# EAGLE design fish_tank (EAGLE 7.5.0)

## Sheet 1 of 2
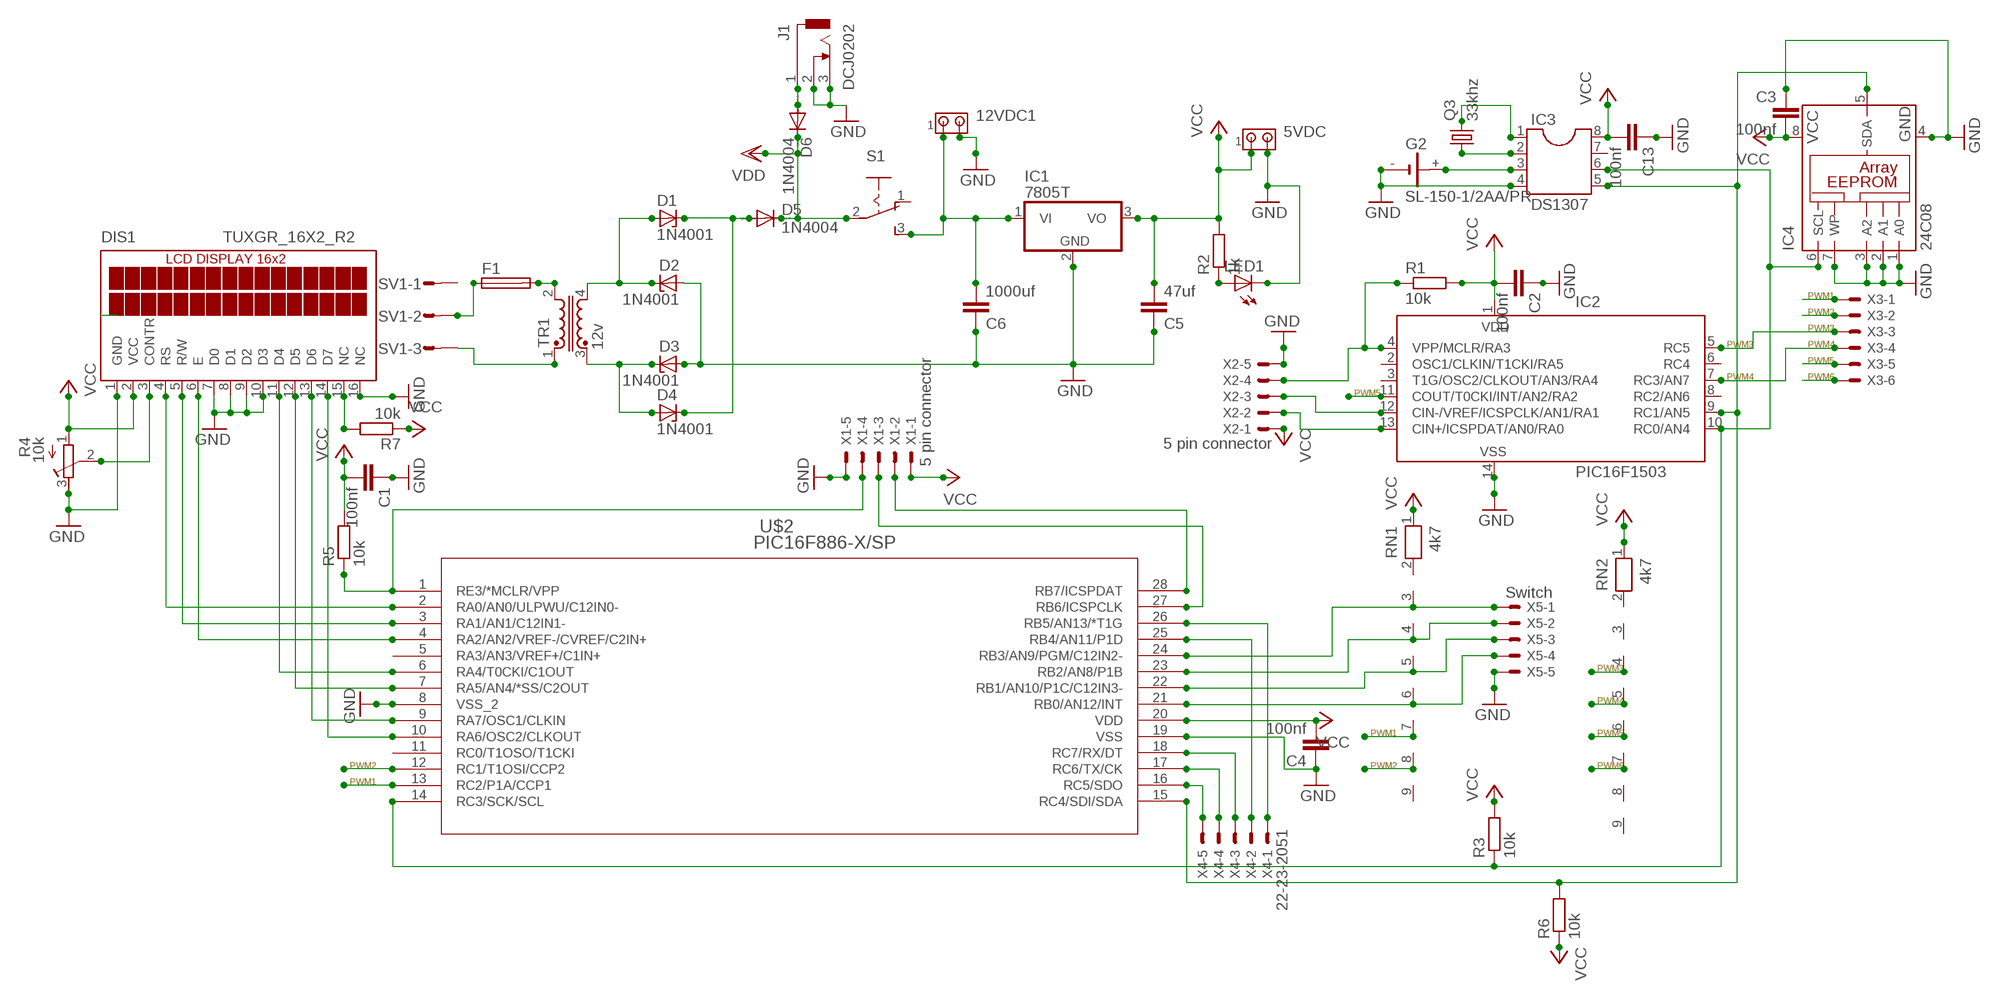
[diagram p0: schematic, sheet 1]

### Parts
5VDC  MTA02-100  [10X02MTA]
12VDC1  MTA02-100  [10X02MTA]
C1  100nf  C2.5/4  [C2.5-4]
C2  100nf  C2.5/4  [C2.5-4]
C3  100nf  C5/2.5  [C5B2.5]
C4  100nf  C2.5/4  [C2.5-4]
C5  47uf  C5/2.5  [C5B2.5]
C6  1000uf  C5/2.5  [C5B2.5]
C13  100nf  C5/2.5  [C5B2.5]
D1  1N4001  1N821  [DO35Z10]
D2  1N4001  1N821  [DO35Z10]
D3  1N4001  1N821  [DO35Z10]
D4  1N4001  1N821  [DO35Z10]
D5  1N4004  [DO41-10]
D6  1N4004  [DO41-10]
DIS1  TUXGR_16X2_R2  [TUXGR_16X2_R2]
F1  SH25  [SH25]
G2  SL-150-1/2AA/PR  [SL-150-1/2AA/PR]
IC1  7805T  [TO220H]
IC2  PIC16F1503  PIC16F676P  [DIL14]
IC3  DS1307  DIL8  [DIL08]
IC4  24C08  24C04CP  [DIL8]
J1  DCJ0202  [DCJ0202]
LED1  LED3MM  [LED3MM]
Q3  33khz  CRYSTALTC26H  [TC26H]
R1  10k  R-EU_0207/7  [0207/7]
R2  1k  R-EU_0204/5  [0204/5]
R3  10k  R-EU_0207/7  [0207/7]
R4  10k  R-TRIMM64W  [RTRIM64W]
R5  10k  R-EU_0207/7  [0207/7]
R6  10k  R-EU_0207/7  [0207/7]
R7  10k  R-EU_0207/7  [0207/7]
RN1  4k7  RN08  [RN-9]
RN2  4k7  RN08  [RN-9]
S1  255SB  [255SB]
SV1  MT6-3Y  [MT6-3Y]
TR1  12v  U15-TRANSFORMER  [U15]
U$2  PIC16F886-X/SP  [SPDIP28_300MC]
X1  5 pin connector  22-23-2051  [22-23-2051]
X2  5 pin connector  22-23-2051  [22-23-2051]
X3  22-23-2061  [22-23-2061]
X4  22-23-2051  [22-23-2051]
X5  Switch  22-23-2051  [22-23-2051]

### Nets
GND: 5VDC.2 12VDC1.2 C1.1 C2.1 C3.1 C4.1 C5.1 C6.1 C13.1 D2.A D3.A DIS1.1(GND) DIS1.7(D0) DIS1.8(D1) DIS1.9(D2) DIS1.10(D3) DIS1.16(NC) G2.- IC1.2(GND) IC2.14(VSS) IC3.4 IC4.1(A0) IC4.2(A1) IC4.3(A2) IC4.4(GND) IC4.7(WP) J1.2 J1.3 LED1.K(C) R4.3(E) U$2.8(VSS_2) U$2.19(VSS) X1.5 X2.5 X5.5
N$1: D3.C D4.A TR1.3
N$2: D1.A D2.C TR1.4
N$3: RN1.5 U$2.22(RB1/AN10/P1C/C12IN3-) X5.3
N$4: DIS1.3(CONTR) R4.2(S)
N$5: RN1.6 U$2.21(RB0/AN12/INT) X5.4
N$6: IC2.10(RC0/AN4) IC3.6 IC4.6(SCL) R3.1 U$2.14(RC3/SCK/SCL)
N$7: RN1.3 U$2.24(RB3/AN9/PGM/C12IN2-) X5.1
N$8: DIS1.4(RS) U$2.2(RA0/AN0/ULPWU/C12IN0-)
N$9: IC2.13(CIN+/ICSPDAT/AN0/RA0) X2.2
N$10: DIS1.5(R/W) U$2.3(RA1/AN1/C12IN1-)
N$12: IC2.4(VPP/MCLR/RA3) R1.1 X2.4
N$13: DIS1.6(E) U$2.4(RA2/AN2/VREF-/CVREF/C2IN+)
N$14: IC2.9(RC1/AN5) IC3.5 IC4.5(SDA) R6.2 U$2.15(RC4/SDI/SDA)
N$15: U$2.26(RB5/AN13/*T1G) X4.1
N$16: F1.1 SV1.2
N$17: U$2.25(RB4/AN11/P1D) X4.2
N$18: U$2.16(RC5/SDO) X4.5
N$19: U$2.17(RC6/TX/CK) X4.4
N$20: IC2.12(CIN-/VREF/ICSPCLK/AN1/RA1) X2.3
N$21: U$2.18(RC7/RX/DT) X4.3
N$22: RN1.4 U$2.23(RB2/AN8/P1B) X5.2
N$23: D6.A J1.1
N$24: 12VDC1.1 C6.2 IC1.1(VI) S1.3(S)
N$25: IC2.7(RC3/AN7) X3.4
N$26: DIS1.14(D7) U$2.10(RA6/OSC2/CLKOUT)
N$27: DIS1.13(D6) U$2.9(RA7/OSC1/CLKIN)
N$28: DIS1.12(D5) U$2.7(RA5/AN4/*SS/C2OUT)
N$29: DIS1.11(D4) U$2.6(RA4/T0CKI/C1OUT)
N$30: U$2.27(RB6/ICSPCLK) X1.3
N$32: DIS1.15(NC) R7.2
N$34: U$2.28(RB7/ICSPDAT) X1.2
N$36: R5.1 U$2.1(RE3/*MCLR/VPP) X1.4
N$38: SV1.3 TR1.1
N$61: F1.2 TR1.2
N$63: G2.+ IC3.3
N$64: IC3.2 Q3.1
N$65: D1.C D4.C D5.A
N$66: LED1.A R2.1
N$70: IC3.1 Q3.2
PWM1: RN1.7 U$2.13(RC2/P1A/CCP1) X3.1
PWM2: RN1.8 U$2.12(RC1/T1OSI/CCP2) X3.2
PWM3: IC2.5(RC5) RN2.4 X3.3
PWM4: RN2.5
PWM5: IC2.11(COUT/T0CKI/INT/AN2/RA2) RN2.6 X3.5
PWM6: RN2.7 X3.6
VCC: 5VDC.1 C1.2 C2.2 C3.2 C4.2 C5.2 C13.2 DIS1.2(VCC) IC1.3(VO) IC2.1(VDD) IC3.8 IC4.8(VCC) R1.2 R2.2 R3.2 R4.1(A) R5.2 R6.1 R7.1 RN1.1 RN2.1 U$2.20(VDD) X1.1 X2.1
VDD: D5.C D6.C S1.2(P)
Unconnected: IC2.2(OSC1/CLKIN/T1CKI/RA5) IC2.3(T1G/OSC2/CLKOUT/AN3/RA4) IC2.6(RC4) IC2.8(RC2/AN6) IC3.7 RN1.2 RN1.9 RN2.2 RN2.3 RN2.8 RN2.9 S1.1(O) SV1.1 U$2.5(RA3/AN3/VREF+/C1IN+) U$2.11(RC0/T1OSO/T1CKI)

### Notes on the sheet
- PWM1
- PWM2
- PWM3
- PWM3 | PWM4
- PWM5
- PWM4 | PWM6
- PWM5
- PWM3
- PWM4
- PWM1 | PWM5
- PWM2 | PWM2 | PWM6
- PWM1

## Sheet 2 of 2

## Library data of the parts
5VDC 12VDC1 = con-amp:MTA02-100: AMP connector
C1-C6 C13 = capacitor-wima:C: CAPACITOR naming: grid - package width
D1-D4 = diode:1N821: Reference DIODE temperature compensated, 6,2 V
D5 D6 = diode:1N4004: DIODE general purpose rectifier, 1 A
DIS1 = display-lcd:TUXGR_16X2_R2: Tuxgraphics LCD display 16x2 characters reflective, without background light Source: tuxgr_12x2_r2.pdf; OC_FARNELL: unknown; OC_NEWARK: unknown
F1 = fuse:SH25: FUSE HOLDER grid 25 mm, OGN0031 8211, Schurter (Buerklin); MF: SCHURTER; MPN: 0031.8211; OC_FARNELL: 1162741; OC_NEWARK: 96B9380
G2 = battery:SL-150-1/2AA/PR: LI BATTERY Sonnenschein
IC1 = linear:78*: Positive VOLTAGE REGULATOR Source: http://cache.national.com/ds/LM/LM78L05.pdf http://www.fairchildsemi.com/ds/LM/LM7805.pdf
IC2 = microchip:PIC16F676: 14-Pin, Flash-Based 8-Bit CMOS Microcontroller High Performance RISC CPU: * Only 35 instructions to learn - All single-cycle instructions except branches * Operating speed: - DC - 20 MHz oscillator/clock input - DC - 200 ns instruction cycle * Internal and external oscillator options - Precision Internal 4 MHz oscillator factory calibrated to ±1% - External Oscillator support for crystals and resonators - 5?s wake-up from SLEEP, 3.0V, typical * Power saving SLEEP mode * Wide operating voltage range - 2.0V to 5.5V * Industrial and Extended temperature range * Low power Power-on Reset (POR) * Power-up Timer (PWRT) and Oscillator Start-up Timer (OST) * Brown-out Detect (BOD) * Watchdog Timer (WDT) with independent oscillator for reliable operation * Multiplexed MCLR/Input-pin * Interrupt-on-pin change * Individual programmable weak pull-ups * Programmable code protection * High Endurance FLASH/EEPROM Cell - 100,000 write FLASH endurance - 1,000,000 write EEPROM endurance - FLASH/Data EEPROM Retention: > 40 years * Standby Current: - 1 nA @ 2.0V, typical * Operating Current: - 8.5?A @ 32 kHz, 2.0V, typical - 100?A @ 1 MHz, 2.0V, typical * Watchdog Timer Current - 300 nA @ 2.0V, typical * Timer1 oscillator current: - 4?A @ 32 kHz, 2.0V, typical * 12 I/O pins with individual direction control * High current sink/source for direct LED drive * Analog-to-Digital Converter module (PIC16F676): - 10-bit resolution - Programmable 8-channel input - Voltage reference input * In-Circuit Serial ProgrammingTM (ICSPTM) via two pins Source: http://ww1.microchip.com/downloads/en/DeviceDoc/40039E.pdf; MF: MICROCHIP; MPN: PIC16F676-I/P; OC_FARNELL: 9760512; OC_NEWARK: 54K2829
IC3 = ic-package:DIL8: Dual In Line / Socket
IC4 = microchip:24C*: Serial EEPROM 1 K/2 K/4 K; MPN: CAT24C04LI-G; OC_FARNELL: 1718374; OC_NEWARK: 73P4460
J1 = con-jack:DCJ0202: DC POWER JACK Source: DCJ0202.pdf; OC_FARNELL: unknown; OC_NEWARK: unknown
LED1 = led:LED: LED OSRAM: - CHIPLED LG R971, LG N971, LY N971, LG Q971, LY Q971, LO R971, LY R971 LH N974, LH R974 LS Q976, LO Q976, LY Q976 LO Q996 - Hyper CHIPLED LW Q18S LB Q993, LB Q99A, LB R99A - SideLED LS A670, LO A670, LY A670, LG A670, LP A670 LB A673, LV A673, LT A673, LW A673 LH A674 LY A675 LS A676, LA A676, LO A676, LY A676, LW A676 LS A679, LY A679, LG A679 - Hyper Micro SIDELED® LS Y876, LA Y876, LO Y876, LY Y876 LT Y87S - SmartLED LW L88C, LW L88S LB L89C, LB L89S, LG L890 LS L89K, LO L89K, LY L89K LS L896, LA L896, LO L896, LY L896 - TOPLED LS T670, LO T670, LY T670, LG T670, LP T670 LSG T670, LSP T670, LSY T670, LOP T670, LYG T670 LG T671, LOG T671, LSG T671 LB T673, LV T673, LT T673, LW T673 LH T674 LS T676, LA T676, LO T676, LY T676, LB T676, LH T676, LSB T676, LW T676 LB T67C, LV T67C, LT T67C, LS T67K, LO T67K, LY T67K, LW E67C LS E67B, LA E67B, LO E67B, LY E67B, LB E67C, LV E67C, LT E67C LW T67C LS T679, LY T679, LG T679 LS T770, LO T770, LY T770, LG T770, LP T770 LB T773, LV T773, LT T773, LW T773 LH T774 LS E675, LA E675, LY E675, LS T675 LS T776, LA T776, LO T776, LY T776, LB T776 LHGB T686 LT T68C, LB T68C - Hyper Mini TOPLED® LB M676 - Mini TOPLED Santana® LG M470 LS M47K, LO M47K, LY M47K Source: http://www.osram.convergy.de LUXEON: - LUMILED® LXK2-PW12-R00, LXK2-PW12-S00, LXK2-PW14-U00, LXK2-PW14-V00 LXK2-PM12-R00, LXK2-PM12-S00, LXK2-PM14-U00 LXK2-PE12-Q00, LXK2-PE12-R00, LXK2-PE12-S00, LXK2-PE14-T00, LXK2-PE14-U00 LXK2-PB12-K00, LXK2-PB12-L00, LXK2-PB12-M00, LXK2-PB14-N00, LXK2-PB14-P00, LXK2-PB14-Q00 LXK2-PR12-L00, LXK2-PR12-M00, LXK2-PR14-Q00, LXK2-PR14-R00 LXK2-PD12-Q00, LXK2-PD12-R00, LXK2-PD12-S00 LXK2-PH12-R00, LXK2-PH12-S00 LXK2-PL12-P00, LXK2-PL12-Q00, LXK2-PL12-R00 Source: www.luxeon.com KINGBRIGHT: KA-3528ASYC Source: www.kingbright.com
Q3 = crystal:CRYSTAL: CRYSTAL; OC_FARNELL: unknown; OC_NEWARK: unknown
R1 R3 R5-R7 = rcl:R-EU_: RESISTOR, European symbol
R2 = resistor:R-EU_: RESISTOR, European symbol
R4 = rcl:R-TRIMM: Trimm resistor
RN1 RN2 = resistor-net:RN08: RESISTOR NETWORK; OC_FARNELL: unknown; OC_NEWARK: unknown
S1 = switch:255SB: SLIDING SWITCH Distributor Buerklin, 11G810
SV1 = con-amp-mt:MT6-3Y: AMP MT6 CONNECTOR; OC_FARNELL: unknown; OC_NEWARK: unknown
TR1 = inductor-neosid:U15: TRANSFORMER U15; OC_FARNELL: unknown; OC_NEWARK: unknown
U$2 = pic16f886:PIC16F886-X/SP
X1 X2 X4 X5 = con-molex:22-23-2051: .100" (2.54mm) Center Header - 5 Pin; MF: MOLEX; MPN: 22-23-2051; OC_FARNELL: 1462952; OC_NEWARK: 38C9178
X3 = con-molex:22-23-2061: .100" (2.54mm) Center Header - 6 Pin; MF: MOLEX; MPN: 22-23-2061; OC_FARNELL: 1462922; OC_NEWARK: 27C1933

## Board
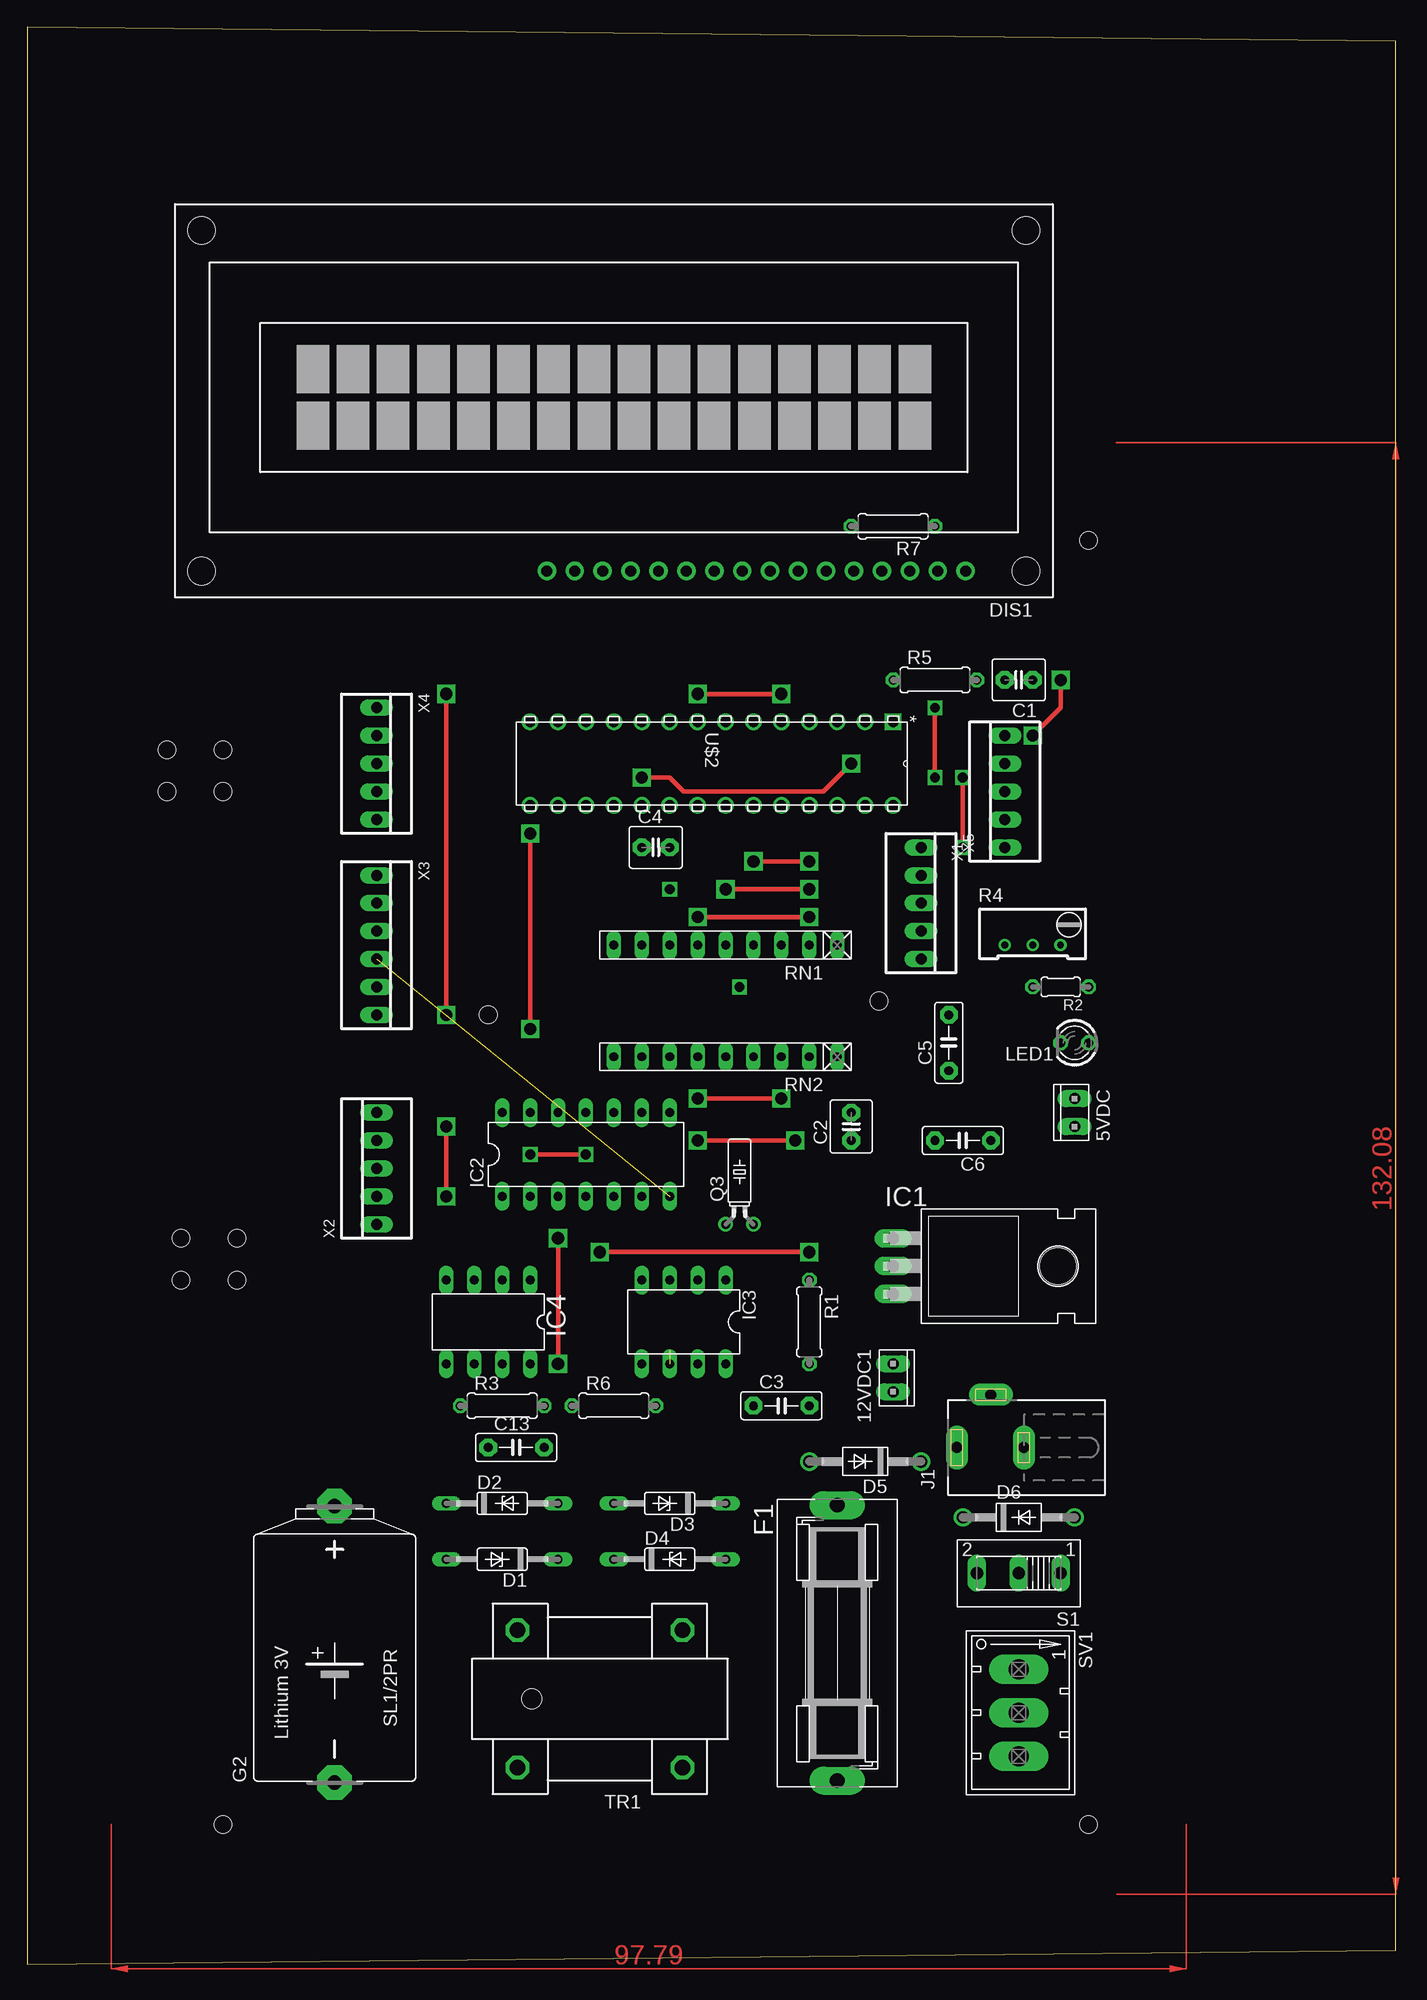
[diagram p1: board, top side]
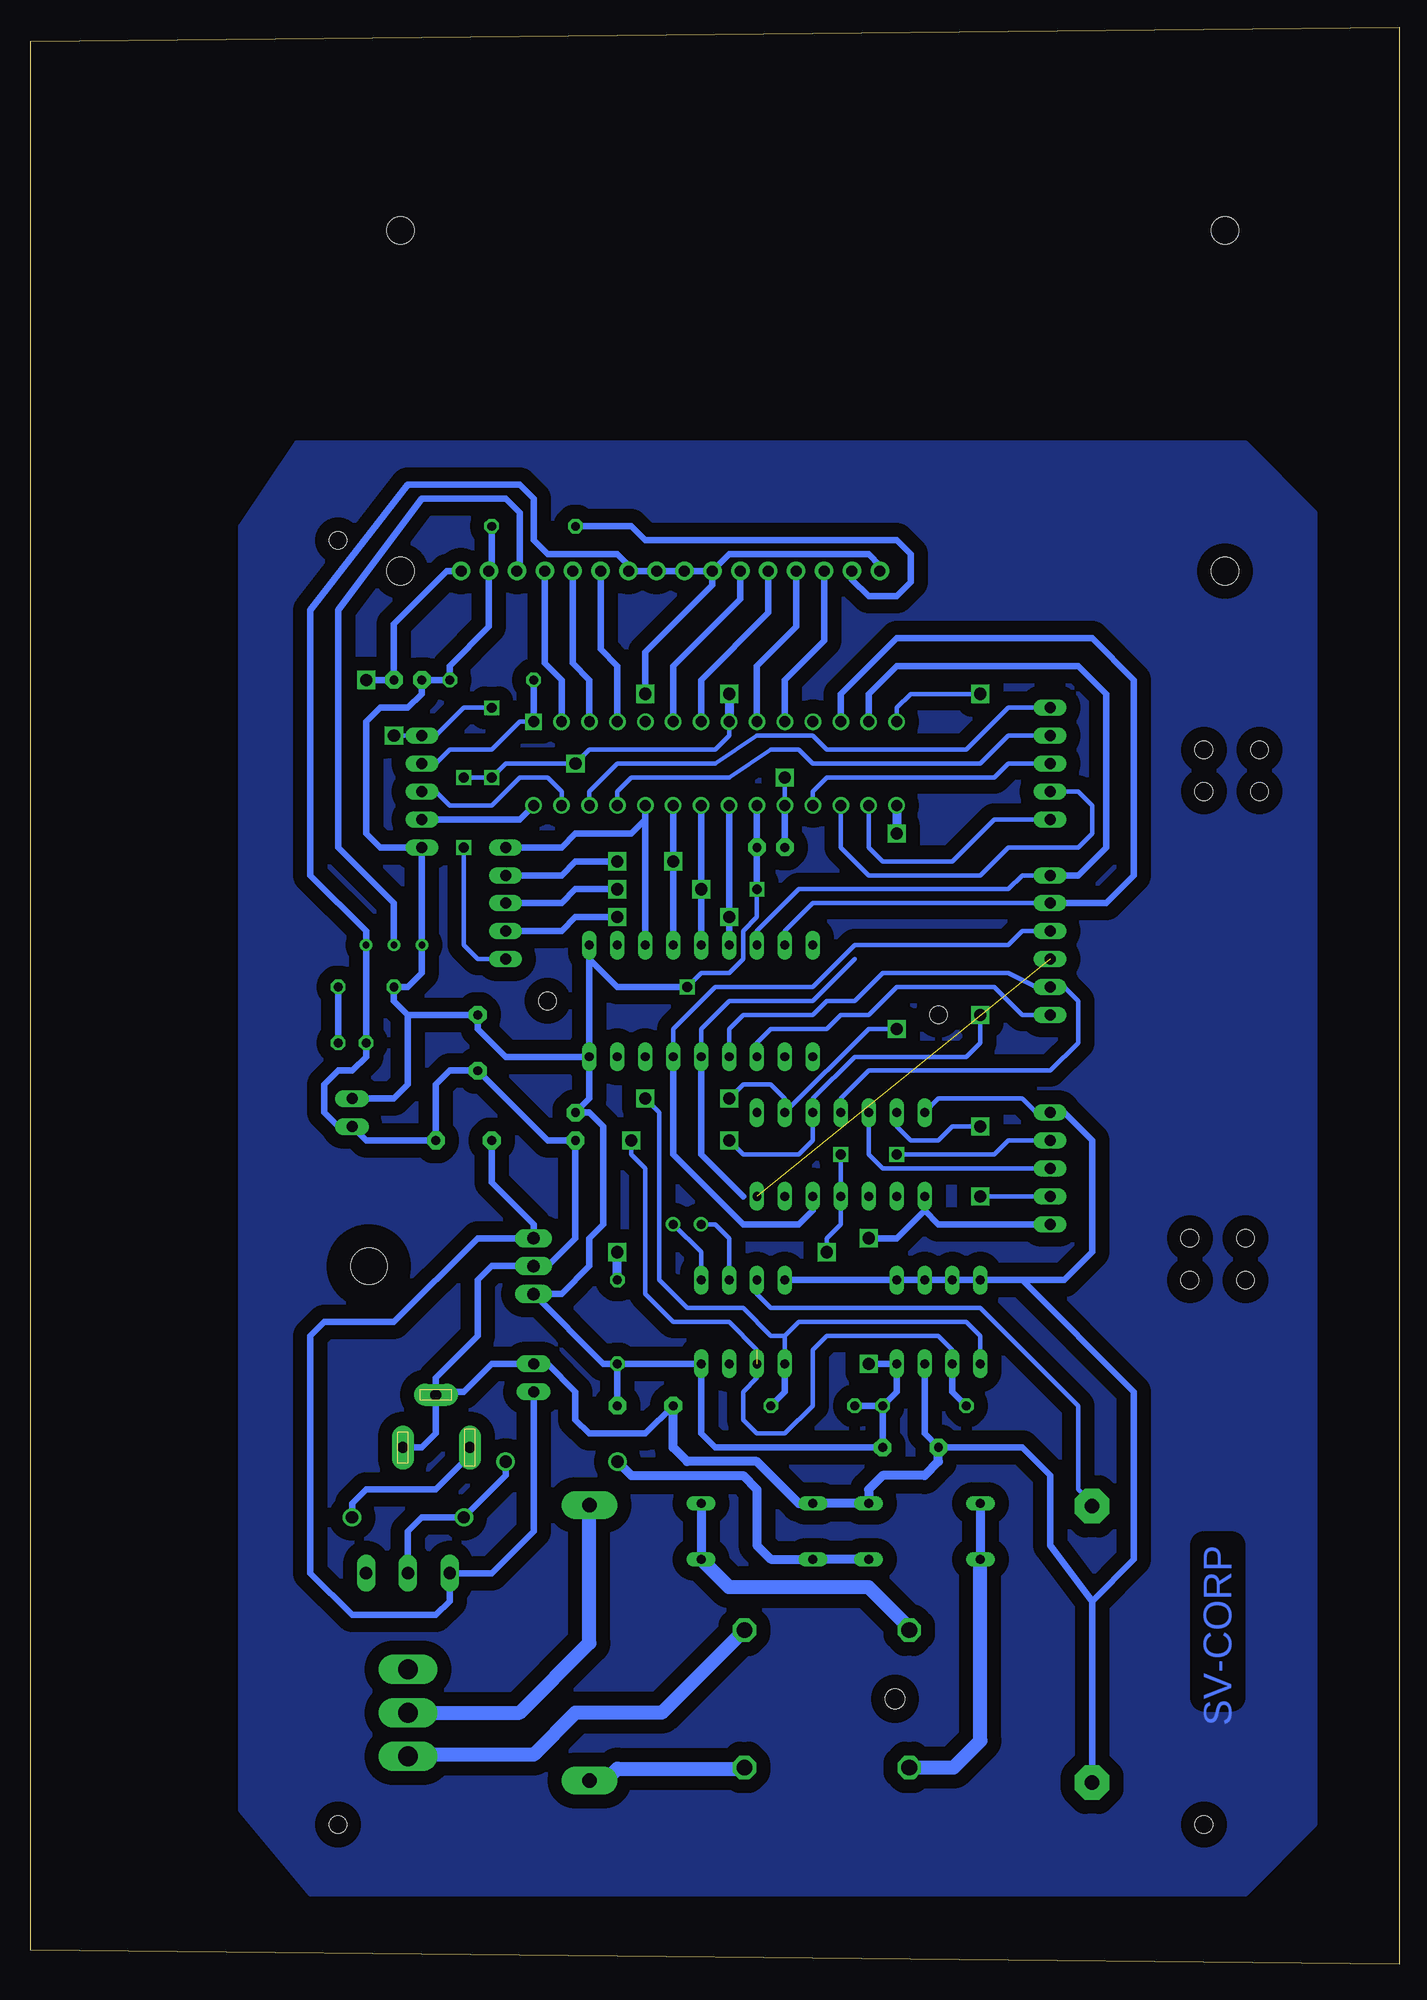
[diagram p2: board, bottom side, seen from below]

Size 124.48 x 176.2 mm. Coordinates in mm from the lower left corner, seen from the top.
Outline: 0,0 124.48,1.27 124.48,174.93 0,176.2 0,0
Copper layers (1*16): Top 0.035mm / dielectric 1.5mm / Bottom 0.035mm
Design rules "default": minimum track width 10mil, minimum drill 24mil, track to track 8mil, track to pad 8mil, pad to pad 8mil, via to via 8mil, smd to smd 8mil, copper to edge 40mil, drill to drill 8mil, minimum pad ring 10mil, minimum via ring 8mil, stop-mask expansion 4mil, vias tented up to drill 0mil, thermal gap 10mil
Holes 1.6 mm at 17.78,12.7 96.52,12.7 96.52,129.54 12.7,110.49 17.78,110.49 12.7,106.68 17.78,106.68 13.97,66.04 19.05,66.04 13.97,62.23 19.05,62.23 41.91,86.36 77.47,87.63

### Footprints (pad centres in the part's own frame; a part is rotated, then mirrored left to right if it is on the bottom)
10X02MTA = drill 1.016 long: 1 1.27,0; 2 -1.27,0
C2.5-4 = drill 0.813 pad 1.6 octagon: 1 -1.27,0; 2 1.27,0
C5B2.5 = drill 0.813 pad 1.6 octagon: 1 -2.54,0; 2 2.54,0
DO35Z10 = drill 0.813 long: A 5.08,0; C -5.08,0
DO41-10 = drill 1.118: A 5.08,0; C -5.08,0
TUXGR_16X2_R2 = drill 1 pad 1.676: 1 -32,15.5; 2 -29.46,15.5; 3 -26.92,15.5; 4 -24.38,15.5; 5 -21.84,15.5; 6 -19.3,15.5; 7 -16.76,15.5; 8 -14.22,15.5; 9 -11.68,15.5; 10 -9.14,15.5; 11 -6.6,15.5; 12 -4.06,15.5; 13 -1.52,15.5; 14 1.02,15.5; 15 3.56,15.5; 16 6.1,15.5 | hole 2.5: -37.5,-15.5; 37.5,-15.5; -37.5,15.5; 37.5,15.5
SH25 = drill 1.321 pad 2.54 long: 1 -12.522,0; 2 12.522,0
SL-150-1/2AA/PR = drill 1.321 pad 3.15 octagon: + 12.446,0; - -12.7,0
TO220H = drill 1.118 long: 1 -2.54,-10.16; 2 0,-10.16; 3 2.54,-10.16 | hole 3.302: 0,4.826
DIL14 = drill 0.813 long: 1 -7.62,-3.81; 2 -5.08,-3.81; 3 -2.54,-3.81; 4 0,-3.81; 5 2.54,-3.81; 6 5.08,-3.81; 7 7.62,-3.81; 8 7.62,3.81; 9 5.08,3.81; 10 2.54,3.81; 11 0,3.81; 12 -2.54,3.81; 13 -5.08,3.81; 14 -7.62,3.81
DIL08 = drill 0.813 long: 1 -3.81,-3.81; 2 -1.27,-3.81; 3 1.27,-3.81; 4 3.81,-3.81; 5 3.81,3.81; 6 1.27,3.81; 7 -1.27,3.81; 8 -3.81,3.81
DIL8 = drill 0.813 long: 1 -3.81,-3.81; 2 -1.27,-3.81; 3 1.27,-3.81; 4 3.81,-3.81; 5 3.81,3.81; 6 1.27,3.81; 7 -1.27,3.81; 8 -3.81,3.81
DCJ0202 = drill 1 pad 2 long: 1 0,3.1; 2 4.8,0; 3 0,-3
LED3MM = drill 0.813 octagon: A -1.27,0; K 1.27,0
TC26H = drill 0.813: 1 -1.27,0; 2 1.27,0
0207/7 = drill 0.813 octagon: 1 -3.81,0; 2 3.81,0
0204/5 = drill 0.813 octagon: 1 -2.54,0; 2 2.54,0
RTRIM64W = drill 0.61: 1 1.27,-2.54; 2 1.27,0; 3 1.27,2.54
RN-9 = drill 0.813 long: 1 -10.16,0; 2 -7.62,0; 3 -5.08,0; 4 -2.54,0; 5 0,0; 6 2.54,0; 7 5.08,0; 8 7.62,0; 9 10.16,0
255SB = drill 1.118 long: 1 -3.81,0; 2 0,0; 3 3.81,0
MT6-3Y = drill 1.803 long: 1 -3.962,0; 2 0,0; 3 3.962,0
U15 = drill 1.422 octagon: 1 -7.5,-6.25; 2 -7.5,6.25; 3 7.5,-6.25; 4 7.5,6.25 | hole 1.8: 6.2,0
SPDIP28_300MC = drill 0.991 square: 1 -7.62,33.02 | drill 0.991: 2 -7.62,30.48; 3 -7.62,27.94; 4 -7.62,25.4; 5 -7.62,22.86; 6 -7.62,20.32; 7 -7.62,17.78; 8 -7.62,15.24; 9 -7.62,12.7; 10 -7.62,10.16; 11 -7.62,7.62; 12 -7.62,5.08; 13 -7.62,2.54; 14 -7.62,0; 15 0,0; 16 0,2.54; 17 0,5.08; 18 0,7.62; 19 0,10.16; 20 0,12.7; 21 0,15.24; 22 0,17.78; 23 0,20.32; 24 0,22.86; 25 0,25.4; 26 0,27.94; 27 0,30.48; 28 0,33.02
22-23-2051 = drill 1 long: 1 -5.08,0; 2 -2.54,0; 3 0,0; 4 2.54,0; 5 5.08,0
22-23-2061 = drill 1 long: 1 -6.35,0; 2 -3.81,0; 3 -1.27,0; 4 1.27,0; 5 3.81,0; 6 6.35,0

### Placement (x,y rotation side)
5VDC  95.25,77.47 90 top
12VDC1  78.74,53.34 270 top
C1  90.17,116.84 180 top
C2  74.93,76.2 90 top
C3  68.58,50.8 0 top
C4  57.15,101.6 0 top
C5  83.82,83.82 90 top
C6  85.09,74.93 180 top
C13  44.45,46.99 0 top
D1  43.18,36.83 180 top
D2  43.18,41.91 0 top
D3  58.42,41.91 180 top
D4  58.42,36.83 0 top
D5  76.2,45.72 180 top
D6  90.17,40.64 0 top
DIS1  53.34,142.24 180 top
F1  73.66,29.21 270 top
G2  27.94,29.21 90 top
IC1  88.9,63.5 270 top
IC2  50.8,73.66 0 top
IC3  59.69,58.42 180 top
IC4  41.91,58.42 180 top
J1  87.63,46.99 90 top
LED1  95.25,83.82 180 top
Q3  64.77,67.31 0 top
R1  71.12,58.42 270 top
R2  93.98,88.9 180 top
R3  43.18,50.8 0 top
R4  91.44,93.98 270 top
R5  82.55,116.84 0 top
R6  53.34,50.8 0 top
R7  78.74,130.81 180 top
RN1  63.5,92.71 180 top
RN2  63.5,82.55 180 top
S1  90.17,35.56 180 top
SV1  90.17,22.86 270 top
TR1  52.07,24.13 180 top
U$2  45.72,105.41 270 top
X1  88.9,106.68 90 top
X2  31.75,72.39 90 top
X3  31.75,92.71 270 top
X4  31.75,109.22 270 top
X5  81.28,96.52 270 top

### Tracks (layer width: path | path; a pad name or v marks a point on that pad's centre or on a via)
GND  (via drill 0.9 pad 1.27, 1.1, 1.1 pad 1.02)
  Top 0.406: v93.98,116.84 93.98,114.3 v91.44,111.76 | v55.88,107.95 58.42,107.95 59.69,106.68 72.39,106.68 v74.93,109.22 | v60.96,115.57 v68.58,115.57 | v85.09,101.6 v85.09,107.95 | v82.55,107.95 v82.55,114.3
  Bottom 0.406: U$2.19 v55.88,107.95 | v85.09,101.6 85.09,92.71 83.82,91.44 X5.5 | U$2.8 60.96,111.76 62.23,110.49 73.66,110.49 v74.93,109.22 81.28,109.22 v82.55,107.95 v85.09,107.95 | X2.5 33.02,77.47 34.29,78.74 41.91,78.74 IC2.14 | v82.55,114.3 85.09,114.3 87.63,111.76 X1.5 v91.44,111.76
  Bottom 0.61: IC1.2 82.55,63.5 83.82,62.23 83.82,57.15 87.63,53.34 J1.2 | J1.2 87.63,48.26 88.9,46.99 J1.3 | DIS1.1 86.62,126.74 91.44,121.92 C1.1 v93.98,116.84 | DIS1.10 DIS1.9 DIS1.8 DIS1.7 | DIS1.10 62.48,125.48 68.58,119.38 v68.58,115.57 | IC3.4 IC4.1 IC4.2 IC4.3 IC4.4 34.29,62.23 | 34.29,62.23 24.13,52.07 24.13,36.83 27.94,33.02 | 27.94,33.02 G2.- | 27.94,33.02 31.75,38.1 31.75,44.45 34.29,46.99 C13.1 43.18,48.26 IC4.7 | X2.5 30.48,77.47 27.94,74.93 27.94,64.77 30.48,62.23 34.29,62.23 | 77.47,63.5 74.93,66.04 C2.1 77.47,74.93 C5.1 86.36,81.28 87.63,80.01 C6.1 93.98,74.93 5VDC.2 96.52,76.2 97.79,77.47 97.79,80.01 96.52,81.28 95.25,81.28 93.98,82.55 LED1.K R4.3 93.98,93.98 99.06,99.06 99.06,123.19 90.17,134.62 80.01,134.62 78.74,133.35 78.74,129.54 77.47,128.27 71.12,128.27 69.85,127 69.85,126.99 | J1.2 87.35,52.07 85.09,52.07 82.55,54.61 12VDC1.2 77.47,54.61 74.93,52.07 74.93,49.53 73.66,48.26 68.58,48.26 C3.1 | U$2.19 C4.1 | DIS1.16 47.24,127.25 48.26,128.27 60.96,128.27 62.23,127 62.23,126.99 DIS1.10
  Bottom 0.813: C13.1 41.91,45.72 43.18,44.45 46.99,44.45 48.26,43.18 D2.A D3.A 54.61,41.91 58.42,45.72 64.77,45.72 66.04,46.99 C3.1 | 69.85,126.99 DIS1.7 | v60.96,115.57 U$2.8 | 77.47,63.5 IC1.2
N$1
  Bottom 0.813: D3.C D4.A
  Bottom 1.27: TR1.3 44.57,30.6 48.26,34.29 60.96,34.29 D4.A
N$2
  Bottom 0.813: D2.C D1.A
  Bottom 1.27: TR1.4 40.54,17.88 38.1,20.32 D1.A
N$3  (via drill 1.1)
  Top 0.406: v63.5,97.79 v71.12,97.79
  Bottom 0.61: U$2.22 v63.5,97.79 RN1.5 | v71.12,97.79 74.93,97.79 76.2,96.52 X5.3
N$4
  Bottom 0.61: 80.01,126.99 80.01,132.08 81.28,133.35 88.9,133.35 96.52,123.19 96.52,101.6 91.44,96.52 R4.2
  Bottom 0.813: 80.01,126.99 DIS1.3
N$5  (via drill 1.1)
  Top 0.406: v60.96,95.25 v71.12,95.25
  Bottom 0.61: U$2.21 v60.96,95.25 RN1.6 | v71.12,95.25 74.93,95.25 76.2,93.98 X5.4
N$6  (via drill 1.1)  (1 unrouted)
  Top 0.406: v60.96,74.93 v69.85,74.93 | v38.1,115.57 v38.1,86.36
  Bottom 0.406: v38.1,86.36 38.1,83.82 39.37,82.55 49.53,82.55 53.34,78.74 IC2.10 53.34,74.93 54.61,73.66 59.69,73.66 v60.96,74.93 | v38.1,115.57 44.45,115.57 45.72,114.3 U$2.14 | IC4.6 40.64,55.88 41.91,57.15 52.07,57.15 53.34,55.88 53.34,50.8 55.88,48.26 58.42,48.26 59.69,49.53 59.69,52.07 58.42,53.34 58.42,55.88 60.96,58.42 66.04,58.42 68.58,60.96 68.58,72.39 69.85,73.66 v69.85,74.93
  Bottom 0.61: IC4.6 40.64,52.07 R3.1
N$7
  Bottom 0.61: U$2.24 68.58,104.14 | 68.58,104.14 RN1.3 | X5.1 76.2,101.6 74.93,102.87 69.85,102.87 68.58,104.14
N$8
  Bottom 0.61: DIS1.4 77.72,118.36 76.2,116.84 U$2.2
N$9  (via drill 1.1)
  Top 0.406: v38.1,76.2 v38.1,69.85
  Bottom 0.406: X2.2 v38.1,69.85 | v38.1,76.2 40.64,76.2 41.91,74.93 44.45,74.93 45.72,76.2 IC2.13
N$10
  Bottom 0.61: DIS1.5 75.18,118.36 73.66,116.84 U$2.3
N$11
  pour Bottom (isolate 1.27): 100.33,138.43 13.97,138.43 7.62,132.08 7.62,12.7 13.97,6.35 99.06,6.35 105.41,13.97 105.41,130.81
N$12  (via drill 0.9 pad 0.81, 1.1)
  Top 0.406: v45.72,73.66 v50.8,73.66 | v52.07,64.77 v71.12,64.77
  Bottom 0.406: v52.07,64.77 52.07,66.04 50.8,67.31 IC2.4 v50.8,73.66 | X2.4 35.56,74.93 36.83,73.66 v45.72,73.66
  Bottom 0.813: R1.1 v71.12,64.77
N$13
  Bottom 0.61: DIS1.6 72.64,119.63 71.12,118.11 U$2.4
N$14  (via drill 1.1)
  Top 0.406: v60.96,78.74 v68.58,78.74 | v45.72,102.87 v45.72,85.09
  Bottom 0.406: IC4.5 38.1,57.15 39.37,58.42 54.61,58.42 55.88,57.15 | 55.88,57.15 IC3.5 | v60.96,78.74 59.69,80.01 57.15,80.01 55.88,78.74 IC2.9 48.26,85.09 v45.72,85.09 | 55.88,57.15 57.15,57.15 59.69,59.69 64.77,59.69 67.31,62.23 67.31,77.47 v68.58,78.74
  Bottom 0.61: IC3.5 55.88,52.07 R6.2
  Bottom 0.813: U$2.15 v45.72,102.87
N$15
  Bottom 0.406: X4.1 35.56,114.3 39.37,110.49 52.07,110.49 53.34,111.76 58.42,111.76 62.23,109.22 71.12,109.22 73.66,106.68 U$2.26
N$16
  Bottom 1.27: SV1.2 80.01,22.86 73.66,29.21 F1.1
N$17
  Bottom 0.406: X4.2 35.56,111.76 38.1,109.22 53.34,109.22 54.61,110.49 57.15,110.49 60.96,107.95 69.85,107.95 71.12,106.68 U$2.25
N$18
  Bottom 0.406: X4.5 36.83,104.14 40.64,100.33 46.99,100.33 48.26,101.6 U$2.16
N$19
  Bottom 0.406: X4.4 29.21,106.68 27.94,105.41 27.94,102.87 29.21,101.6 35.56,101.6 38.1,99.06 48.26,99.06 50.8,101.6 U$2.17
N$20
  Bottom 0.406: X2.3 46.99,72.39 48.26,73.66 IC2.12
N$21
  Bottom 0.406: X4.3 35.56,109.22 36.83,107.95 52.07,107.95 53.34,106.68 U$2.18
N$22  (via drill 1.1)
  Top 0.406: v66.04,100.33 v71.12,100.33
  Bottom 0.61: U$2.23 v66.04,100.33 RN1.4 | v71.12,100.33 74.93,100.33 76.2,99.06 X5.2
N$23
  Bottom 0.61: D6.A 95.25,41.91 93.98,43.18 87.63,43.18 84.53,46.28 J1.1
N$24
  Bottom 0.61: C6.2 82.55,71.12 78.74,67.31 IC1.1 83.82,66.04 91.44,58.42 97.79,58.42 99.06,57.15 99.06,35.56 95.25,31.75 87.63,31.75 86.36,33.02 S1.3 82.55,35.56 78.74,39.37 12VDC1.1
N$25  (1 unrouted)
N$26
  Bottom 0.61: DIS1.14 52.32,120.4 55.88,116.84 U$2.10
N$27
  Bottom 0.61: DIS1.13 54.86,121.67 58.42,118.11 U$2.9
N$28
  Bottom 0.61: DIS1.12 57.4,122.94 63.5,116.84 U$2.7
N$29
  Bottom 0.61: DIS1.11 59.94,124.21 66.04,118.11 U$2.6
N$30
  Bottom 0.406: U$2.27 76.2,106.68 77.47,107.95 80.01,107.95 82.55,105.41 86.36,105.41 87.63,106.68 X1.3
N$31  (via drill 1.1 pad 1.02)
  other vias: 60.96,115.57
N$32
  Bottom 0.61: DIS1.15 49.78,125.98 48.26,124.46 45.72,124.46 44.45,125.73 44.45,128.27 45.72,129.54 68.58,129.54 69.85,130.81 R7.2
N$34
  Bottom 0.61: U$2.28 80.01,104.14 X1.2
N$36
  Bottom 0.406: U$2.1 80.01,113.03 82.55,110.49 86.36,110.49 87.63,109.22 X1.4
  Bottom 0.61: U$2.1 R5.1
N$38
  Bottom 1.27: TR1.1 67.09,22.86 74.93,22.86 78.74,19.05 90.02,19.05 SV1.3
N$61
  Bottom 1.27: F1.2 72.21,16.69 71.12,17.78 59.67,17.78 TR1.2
N$63
  Bottom 0.406: 27.94,41.91 29.21,43.18 29.21,50.8 38.1,59.69 57.15,59.69 58.42,60.96 IC3.3
  Bottom 0.61: 27.94,41.91 G2.+
N$64
  Bottom 0.406: Q3.1 62.23,67.31 60.96,66.04 IC3.2
N$65
  Bottom 0.813: D1.C D4.C 57.15,36.83 58.42,38.1 58.42,43.18 59.69,44.45 69.85,44.45 D5.A
N$66
  Bottom 0.61: R2.1 LED1.A
N$70
  Bottom 0.406: Q3.2 63.5,64.77 IC3.1
PWM1
  Bottom 0.406: X3.1 34.29,99.06 35.56,97.79 54.61,97.79 58.42,93.98 RN1.7
  Bottom 0.61: X3.1 29.21,99.06 26.67,101.6 26.67,115.57 29.21,118.11 45.72,118.11 48.26,115.57 U$2.13
PWM2
  Bottom 0.406: X3.2 53.34,96.52 55.88,93.98 RN1.8
  Bottom 0.61: U$2.12 50.8,115.57 45.72,120.65 27.94,120.65 24.13,116.84 24.13,99.06 26.67,96.52 X3.2
PWM3
  Bottom 0.406: RN2.4 66.04,85.09 62.23,88.9 53.34,88.9 49.53,92.71 35.56,92.71 34.29,93.98 X3.3
  Bottom 0.61: RN2.4 66.04,73.66 59.69,67.31 54.61,67.31 53.34,68.58 IC2.5
PWM4
  Bottom 0.406: 49.53,91.44 53.34,87.63 60.96,87.63 63.5,85.09 RN2.5
  Bottom 0.61: RN2.5 63.5,73.66 59.69,69.85
PWM5
  Bottom 0.406: IC2.11 50.8,78.74 48.26,81.28 31.75,81.28 29.21,83.82 29.21,87.63 30.48,88.9 X3.5 33.02,88.9 35.56,90.17 46.99,90.17 49.53,87.63 52.07,87.63 53.34,86.36 59.69,86.36 60.96,85.09 RN2.6
PWM6
  Bottom 0.406: RN2.7 58.42,83.82 57.15,85.09 52.07,85.09 50.8,86.36 48.26,86.36 45.72,88.9 36.83,88.9 34.29,86.36 X3.6
VCC  (via drill 0.9 pad 1.27, 1.1)
  Top 0.406: v48.26,66.04 v48.26,54.61
  Bottom 0.406: v58.42,97.79 58.42,95.25 59.69,93.98 59.69,91.44 60.96,90.17 63.5,90.17 v64.77,88.9
  Bottom 0.61: v58.42,97.79 C4.2 U$2.20 | v48.26,54.61 IC4.8 45.72,52.07 R3.2 | R3.2 C13.2 62.23,46.99 63.5,48.26 IC3.8 R1.2 | R3.2 R6.1 | 90.17,86.36 C5.2 83.82,85.09 81.28,82.55 RN2.1 | 90.17,86.36 91.44,87.63 R2.2 90.17,88.9 88.9,90.17 R4.1 X1.1 92.71,101.6 93.98,102.87 93.98,113.03 92.71,114.3 90.17,114.3 88.9,115.57 C1.2 R5.2 86.36,118.11 82.8,121.67 DIS1.2 82.55,126.99 R7.1 | 5VDC.1 91.44,78.74 90.17,80.01 90.17,86.36 | R1.2 72.39,54.61 IC1.3 76.2,60.96 73.66,63.5 73.66,66.04 72.39,67.31 72.39,76.2 73.66,77.47 C2.2 73.66,78.74 RN2.1 | R1.2 C3.2 | X2.1 41.91,67.31 43.18,68.58 | 43.18,68.58 IC2.1 | v48.26,66.04 45.72,66.04 43.18,68.58 | v64.77,88.9 71.12,88.9 73.66,91.44 RN1.1 RN2.1
VDD
  Bottom 0.61: D5.C 81.28,44.45 D6.C 88.9,40.64 90.17,39.37 S1.2
(copper drawn outside any net)
  shapes: Top area x2

### Text on the board
Bottom: SV-CORP